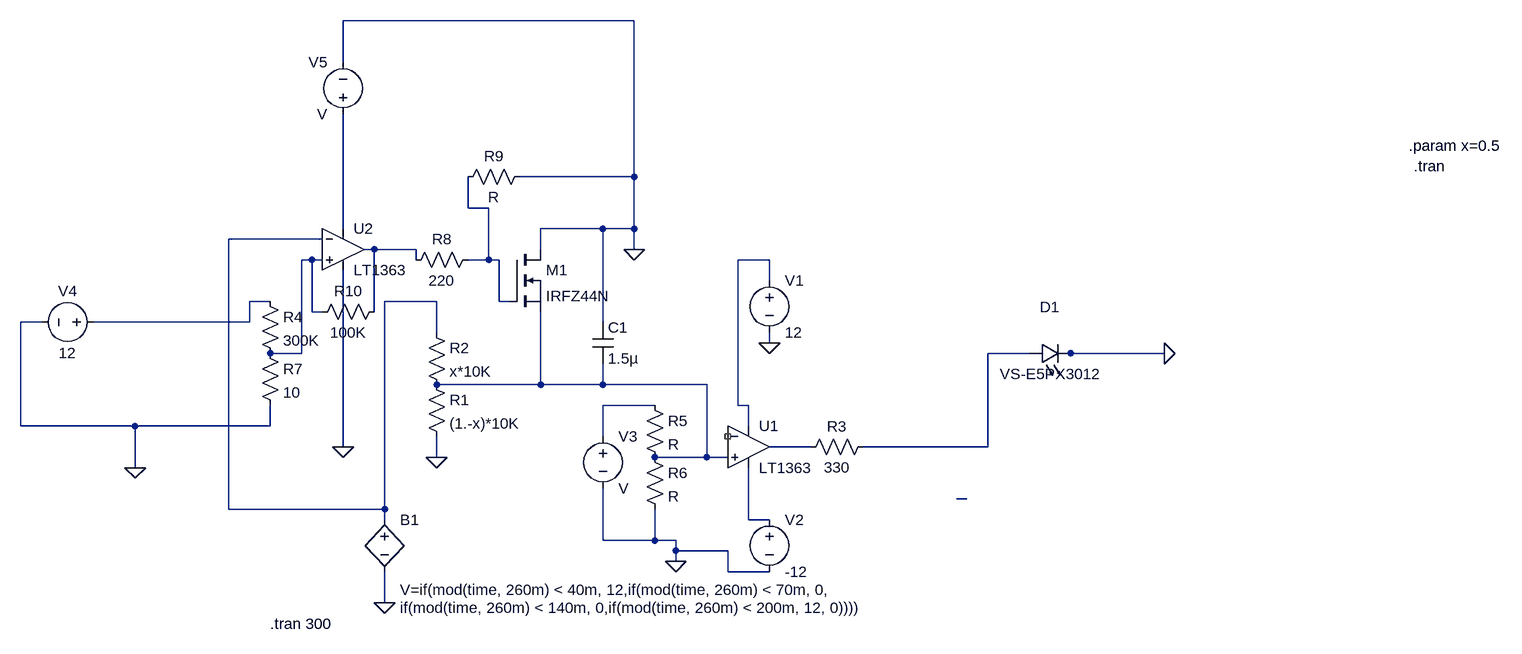
[diagram p0: schematic pulse_duration_detector_full.asc]
pulse_duration_detector_full.asc, the LTspice schematic file:
Version 4.1
SHEET 1 1772 752
WIRE -288 -416 -736 -416
WIRE -736 -352 -736 -416
WIRE -288 -176 -288 -416
WIRE -288 -176 -464 -176
WIRE -544 -128 -544 -176
WIRE -512 -128 -544 -128
WIRE -736 -96 -736 -272
WIRE -336 -96 -432 -96
WIRE -288 -96 -288 -176
WIRE -288 -96 -336 -96
WIRE -768 -80 -912 -80
WIRE -688 -64 -704 -64
WIRE -624 -64 -688 -64
WIRE -432 -64 -432 -96
WIRE -288 -64 -288 -96
WIRE -784 -48 -800 -48
WIRE -768 -48 -784 -48
WIRE -624 -48 -624 -64
WIRE -512 -48 -512 -128
WIRE -512 -48 -544 -48
WIRE -496 -48 -512 -48
WIRE -80 -48 -128 -48
WIRE -80 -16 -80 -48
WIRE -848 16 -880 16
WIRE -592 16 -672 16
WIRE -496 16 -496 -48
WIRE -480 16 -496 16
WIRE -784 32 -784 -48
WIRE -768 32 -784 32
WIRE -688 32 -688 -64
WIRE -1200 48 -1232 48
WIRE -880 48 -880 16
WIRE -880 48 -1120 48
WIRE -336 48 -336 -96
WIRE -592 64 -592 16
WIRE -80 80 -80 64
WIRE -800 96 -800 -48
WIRE -800 96 -848 96
WIRE 320 96 256 96
WIRE 384 96 368 96
WIRE 528 96 384 96
WIRE -432 144 -432 32
WIRE -432 144 -592 144
WIRE -336 144 -336 112
WIRE -336 144 -432 144
WIRE -176 144 -336 144
WIRE -256 176 -336 176
WIRE -128 176 -128 -48
WIRE -112 176 -128 176
WIRE -1232 208 -1232 48
WIRE -1056 208 -1232 208
WIRE -848 208 -848 176
WIRE -848 208 -1056 208
WIRE -112 208 -112 176
WIRE -336 224 -336 176
WIRE -736 240 -736 -32
WIRE -16 240 -80 240
WIRE 256 240 256 96
WIRE 256 240 64 240
WIRE -592 256 -592 224
WIRE -176 256 -176 144
WIRE -176 256 -256 256
WIRE -144 256 -176 256
WIRE -1056 272 -1056 208
WIRE 224 320 208 320
WIRE -912 336 -912 -80
WIRE -672 336 -672 16
WIRE -672 336 -912 336
WIRE -672 352 -672 336
WIRE -112 352 -112 272
WIRE -80 352 -112 352
WIRE -336 384 -336 304
WIRE -256 384 -256 336
WIRE -256 384 -336 384
WIRE -224 384 -256 384
WIRE -224 400 -224 384
WIRE -144 400 -224 400
WIRE -224 416 -224 400
WIRE -144 432 -144 400
WIRE -80 432 -144 432
WIRE -672 480 -672 432
FLAG -592 256 0
FLAG -288 -64 0
FLAG -224 416 0
FLAG -80 80 0
FLAG -672 480 0
FLAG 528 96 0
FLAG -1056 272 0
FLAG -736 240 0
SYMBOL bv -672 336 R0
WINDOW 39 24 124 Left 2
WINDOW 40 24 152 Left 2
SYMATTR SpiceLine V=if(mod(time, 260m) < 40m, 12,if(mod(time, 260m) < 70m, 0,
SYMATTR SpiceLine2 if(mod(time, 260m) < 140m, 0,if(mod(time, 260m) < 200m, 12, 0))))
SYMATTR InstName B1
SYMATTR Value ""
SYMBOL OpAmps\\LT1363 -112 176 R0
SYMATTR InstName U1
SYMBOL res -608 128 R0
SYMATTR InstName R1
SYMATTR Value (1.-x)*10K
SYMBOL res -608 48 R0
SYMATTR InstName R2
SYMATTR Value x*10K
SYMBOL cap -352 48 R0
SYMATTR InstName C1
SYMATTR Value 1.5µ
SYMBOL voltage -80 -32 R0
WINDOW 123 0 0 Left 0
WINDOW 39 0 0 Left 0
SYMATTR InstName V1
SYMATTR Value 12
SYMBOL voltage -80 336 R0
WINDOW 123 0 0 Left 0
WINDOW 39 0 0 Left 0
SYMATTR InstName V2
SYMATTR Value -12
SYMBOL voltage -336 208 R0
WINDOW 123 0 0 Left 0
WINDOW 39 0 0 Left 0
SYMATTR InstName V3
SYMBOL res 80 224 R90
WINDOW 0 0 56 VBottom 2
WINDOW 3 32 56 VTop 2
SYMATTR InstName R3
SYMATTR Value 330
SYMBOL LED 320 112 R270
WINDOW 0 72 32 VTop 2
WINDOW 3 0 32 VBottom 2
SYMATTR InstName D1
SYMATTR Value VS-E5PX3012
SYMBOL res -272 160 R0
SYMATTR InstName R5
SYMBOL res -272 240 R0
SYMATTR InstName R6
SYMBOL nmos -480 -64 R0
SYMATTR InstName M1
SYMATTR Value IRFZ44N
SYMBOL OpAmps\\LT1363 -736 -128 R0
SYMATTR InstName U2
SYMBOL res -864 0 R0
SYMATTR InstName R4
SYMATTR Value 300K
SYMBOL res -864 80 R0
SYMATTR InstName R7
SYMATTR Value 10
SYMBOL voltage -1104 48 R90
WINDOW 0 -32 56 VBottom 2
WINDOW 3 32 56 VTop 2
WINDOW 123 0 0 Left 0
WINDOW 39 0 0 Left 0
SYMATTR InstName V4
SYMATTR Value 12
SYMBOL res -528 -64 R90
WINDOW 0 0 56 VBottom 2
WINDOW 3 32 56 VTop 2
SYMATTR InstName R8
SYMATTR Value 220
SYMBOL res -448 -192 R90
WINDOW 0 0 56 VBottom 2
WINDOW 3 32 56 VTop 2
SYMATTR InstName R9
SYMBOL res -672 16 R90
WINDOW 0 0 56 VBottom 2
WINDOW 3 32 56 VTop 2
SYMATTR InstName R10
SYMATTR Value 100K
SYMBOL voltage -736 -256 R180
WINDOW 0 24 96 Left 2
WINDOW 3 24 16 Left 2
SYMATTR InstName V5
TEXT 904 -224 Left 2 !.param x=0.5
TEXT -848 512 Left 2 !.tran 300
TEXT 912 -192 Left 2 !.tran

The netlist it stands for:
* pulse_duration_detector_full.asc
B1 N003 0 V=if(mod(time, 260m) < 40m, 12,if(mod(time, 260m) < 70m, 0, if(mod(time, 260m) < 140m, 0,if(mod(time, 260m) < 200m, 12, 0))))
X§U1 N009 NC_01 N006 N013 N011 LT1363  ; pins In+ In- V+ V- OUT
R1 N009 0 (1.-x)*10K
R2 N003 N009 x*10K
C1 0 N009 1.5µ
V1 N006 0 12
V2 N013 0 -12
V3 N010 0 V
R3 N008 N011 330
D1 N008 0 VS-E5PX3012
R5 N010 N009 R
R6 N009 0 R
M1 0 N001 N009 N009 IRFZ44N
X§U2 N005 N003 N002 0 N004 LT1363  ; pins In+ In- V+ V- OUT
R4 N007 N005 300K
R7 N005 0 10
V4 N007 0 12
R8 N001 N004 220
R9 0 N001 R
R10 N004 N005 100K
V5 N002 0 V
.model D D
.lib standard.dio
.model NMOS NMOS
.model PMOS PMOS
.lib standard.mos
.param x=0.5
.tran 300
.tran
.lib LT1363.sub
.backanno
.end